# Altium schematic sheet IPMC.SchDoc: =TITLE
size A3; DocumentNumber: 1; SheetNumber: 1; SheetTotal: 11
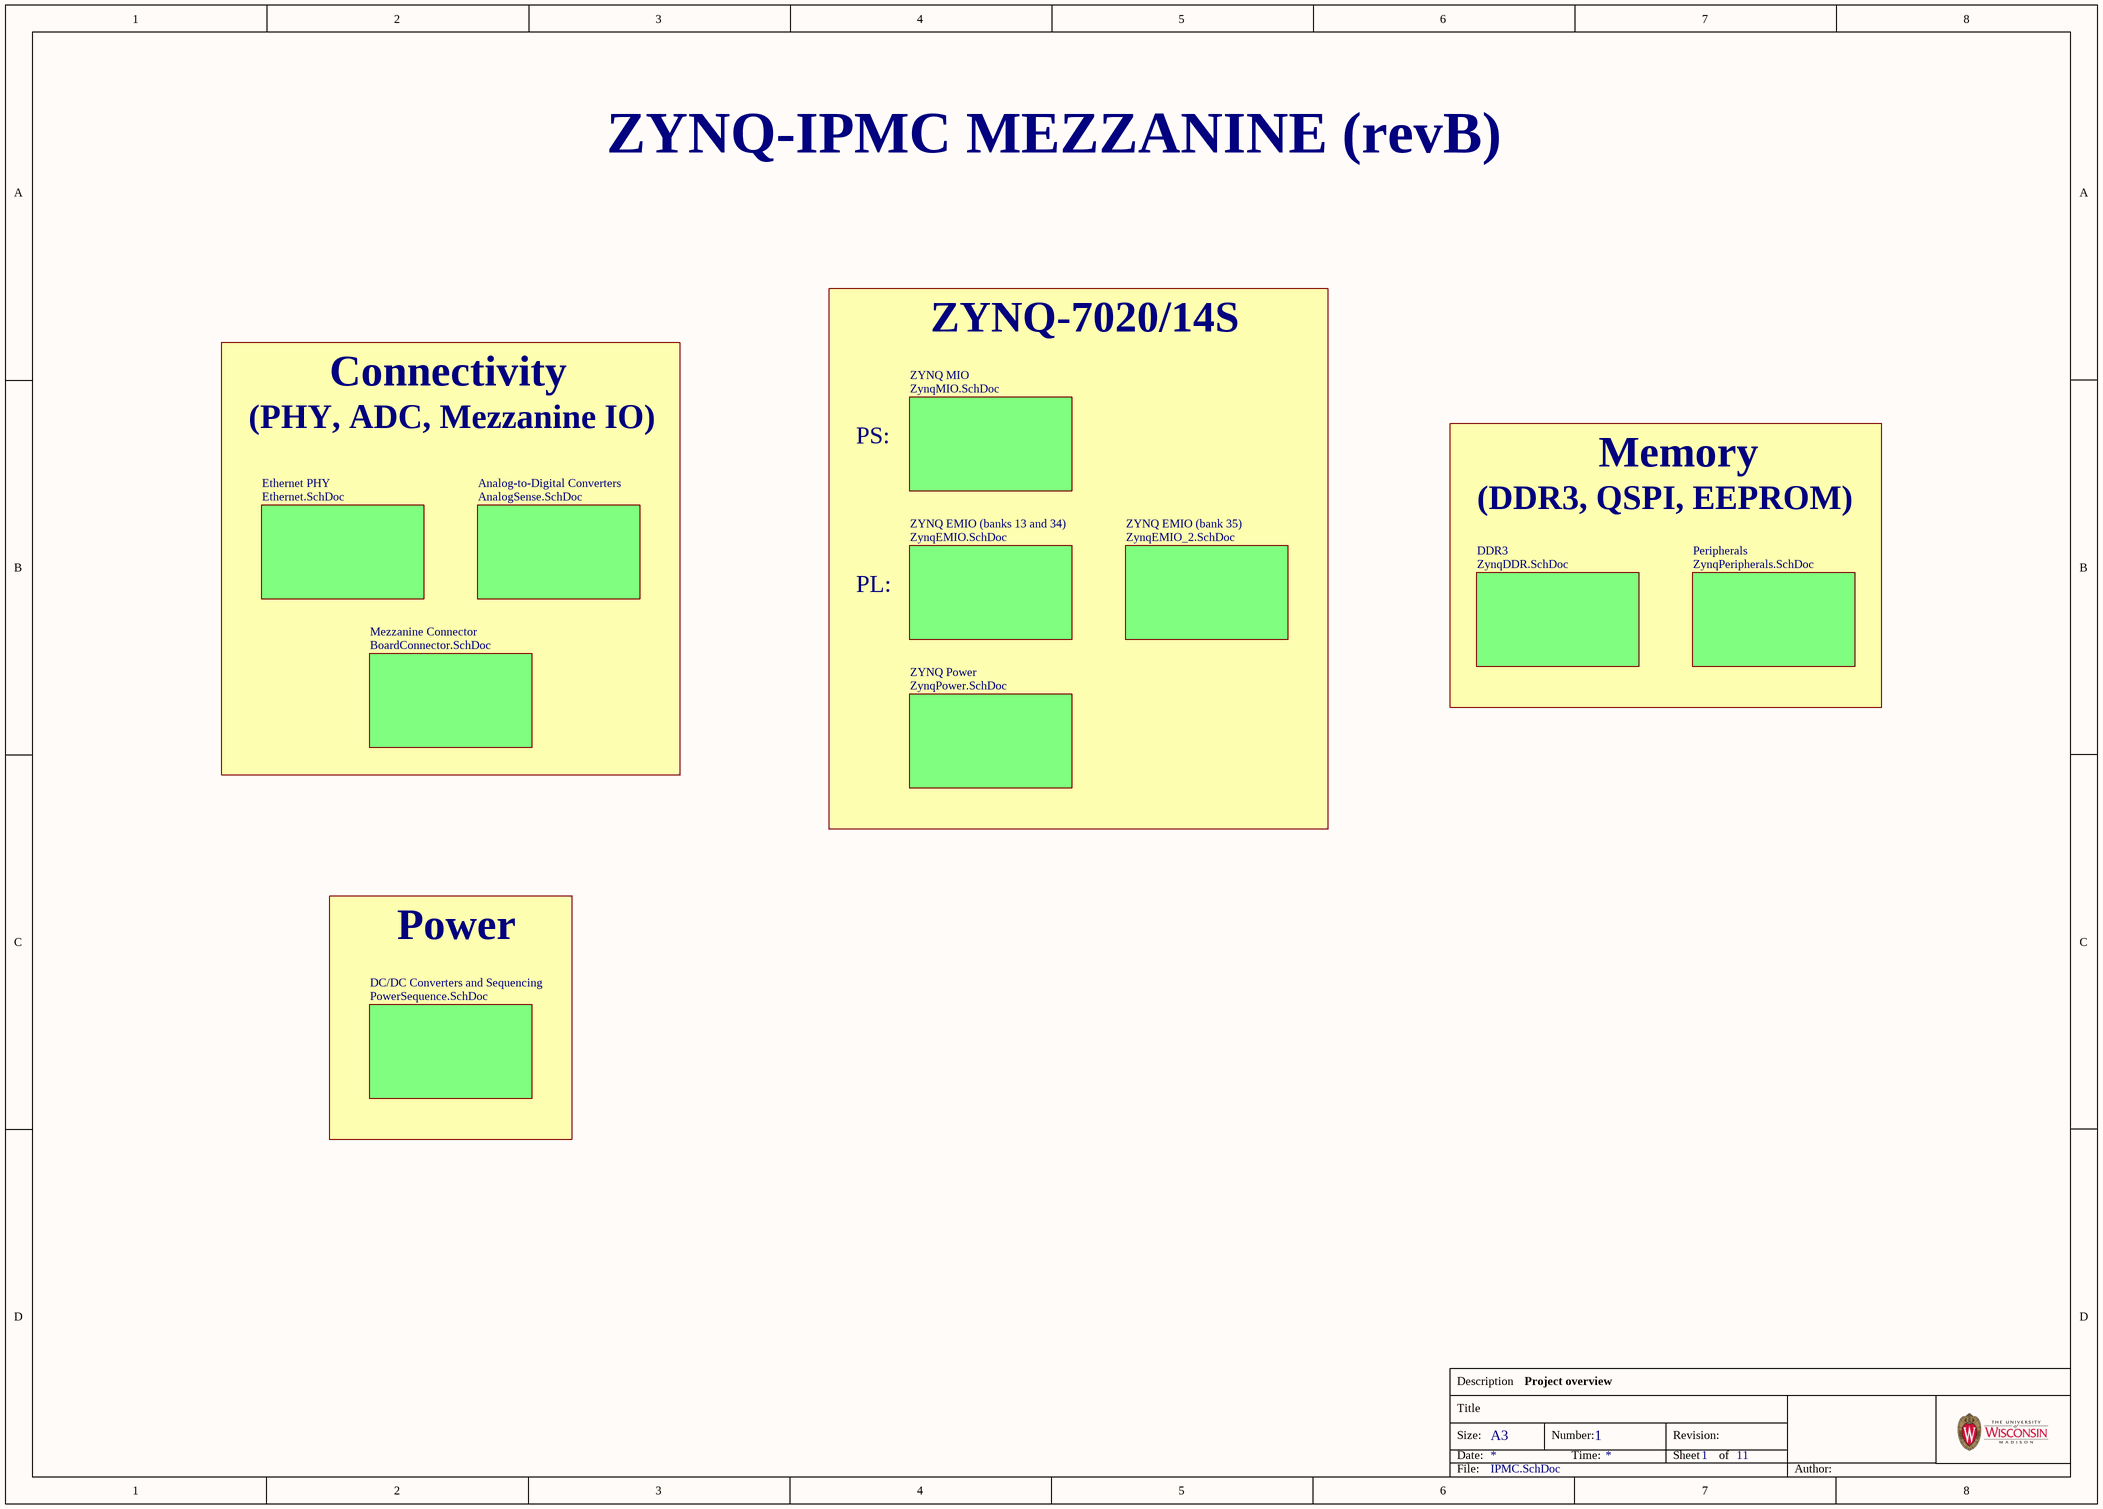
[diagram p0: IPMC.SchDoc]

## Sub-sheets
Analog-to-Digital Converters = AnalogSense.SchDoc: no entries
DC/DC Converters and Sequencing = PowerSequence.SchDoc: no entries
DDR3 = ZynqDDR.SchDoc: no entries
Ethernet PHY = Ethernet.SchDoc: no entries
Mezzanine Connector = BoardConnector.SchDoc: no entries
Peripherals = ZynqPeripherals.SchDoc: no entries
ZYNQ EMIO (bank 35) = ZynqEMIO_2.SchDoc: no entries
ZYNQ EMIO (banks 13 and 34) = ZynqEMIO.SchDoc: no entries
ZYNQ MIO = ZynqMIO.SchDoc: no entries
ZYNQ Power = ZynqPower.SchDoc: no entries

## Notes on the sheet
- ZYNQ-IPMC MEZZANINE (revB)
- ZYNQ-7020/14S
- (PHY, ADC, Mezzanine IO)
- Connectivity
- PS:
- (DDR3, QSPI, EEPROM)
- Memory
- PL:
- Power
- Project overview
- Description
- Title
- Size:
- Date:
- A3
- Number:
- Time:
- Revision:
- Sheet
- of
- File:
- Author: